# EAGLE schematic Interface (EAGLE 9.6.2)
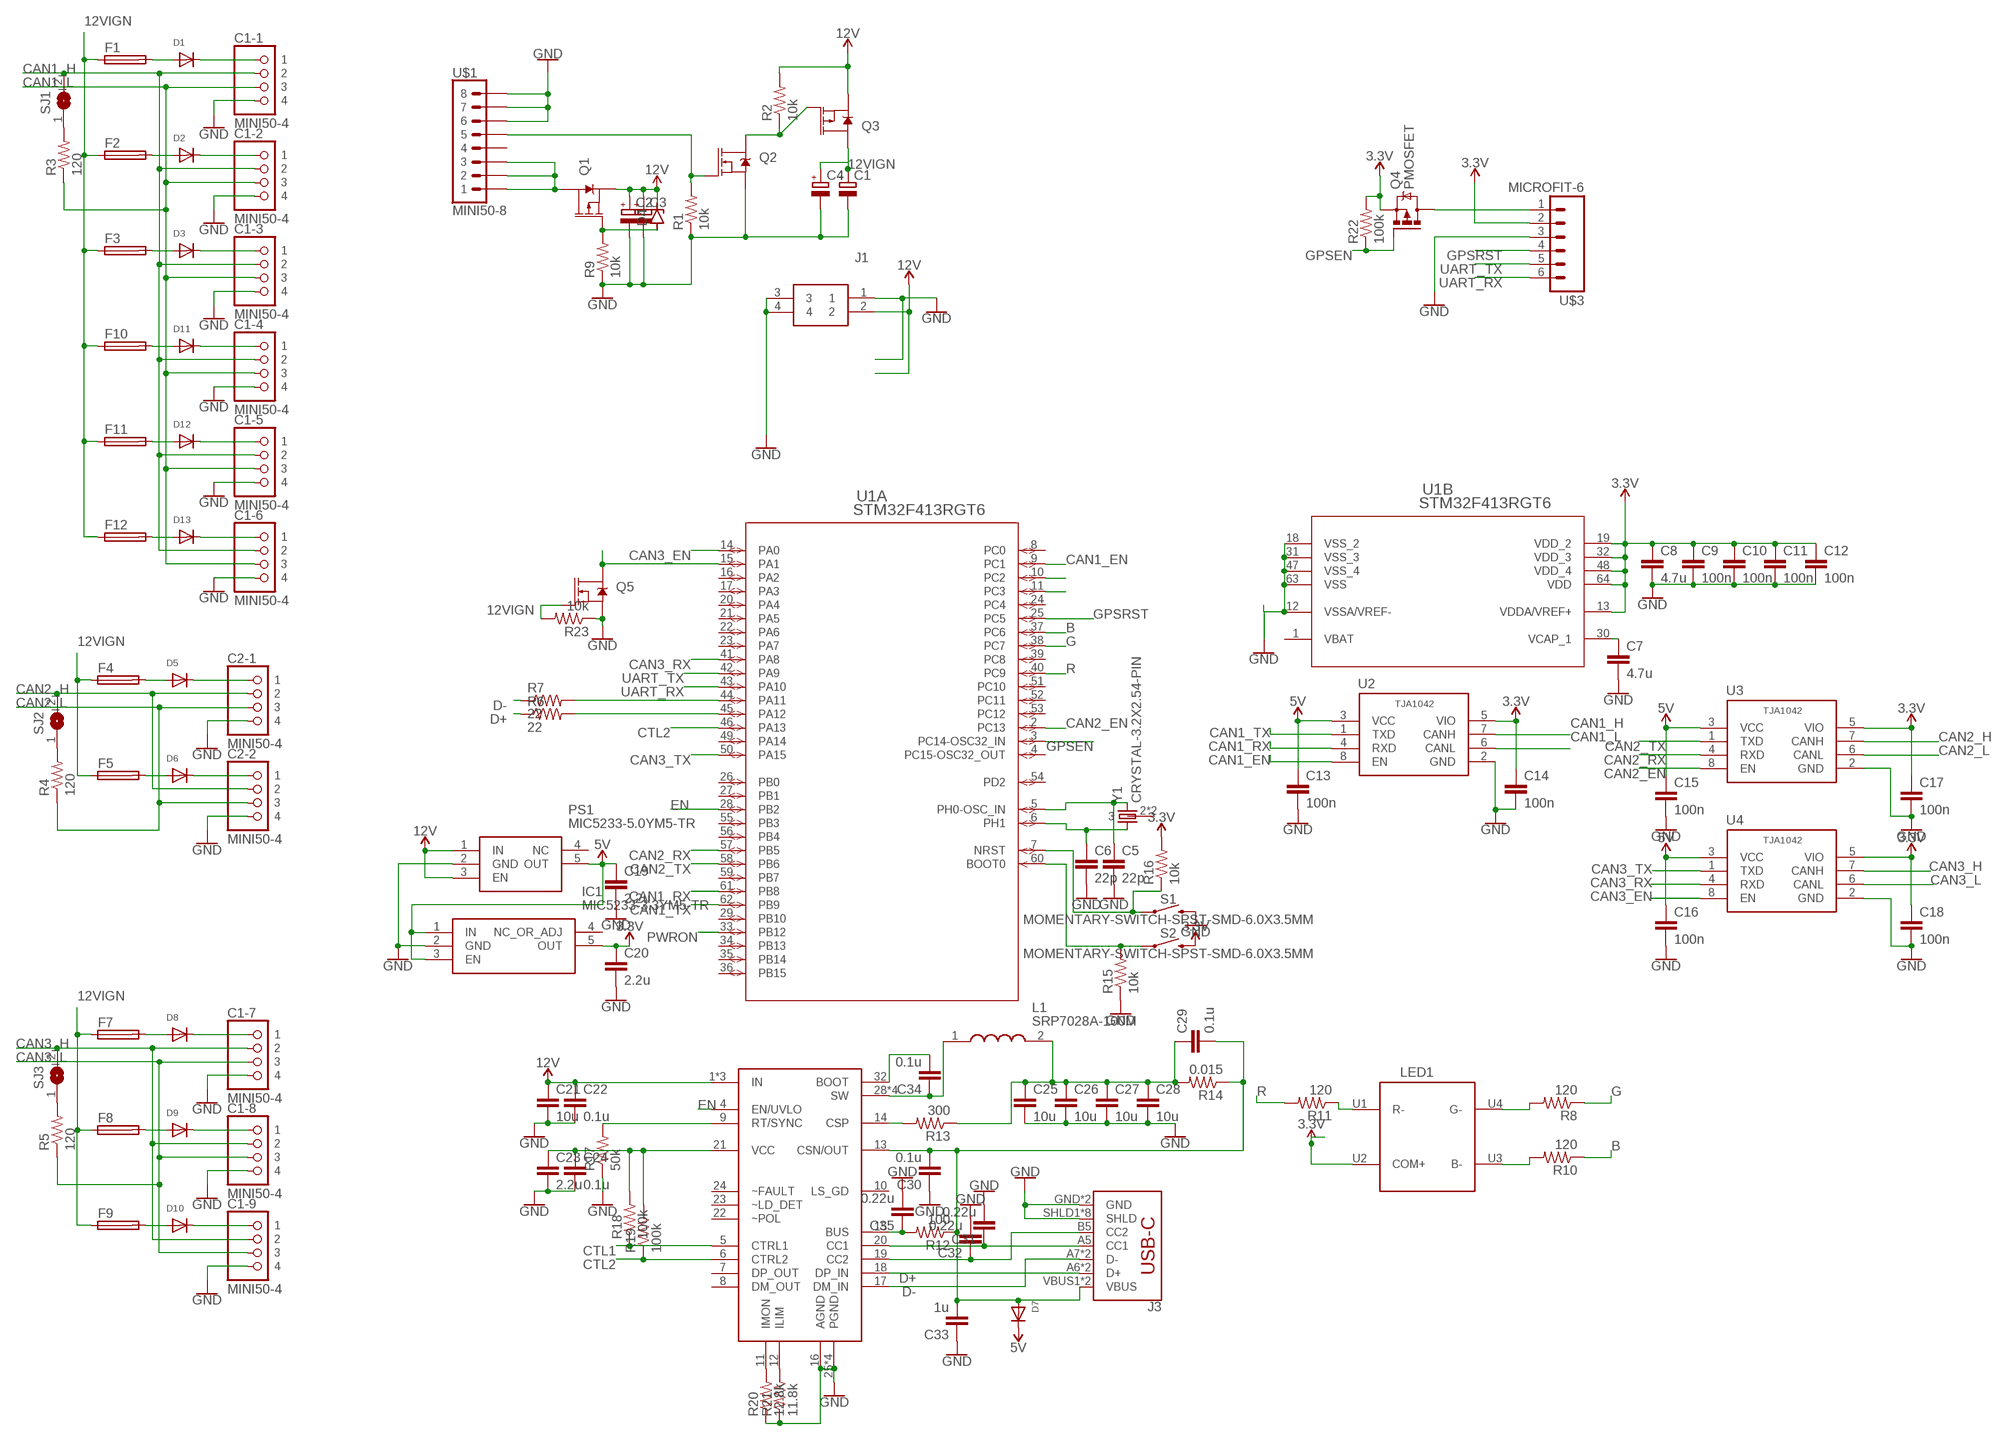
[diagram p0: schematic, sheet 1]

## Parts
C1  CPOL-EU153CLV-1010  [153CLV-1010]
C1-1  MINI50-4  [MINI50]
C1-2  MINI50-4  [MINI50]
C1-3  MINI50-4  [MINI50]
C1-4  MINI50-4  [MINI50]
C1-5  MINI50-4  [MINI50]
C1-6  MINI50-4  [MINI50]
C1-7  MINI50-4  [MINI50]
C1-8  MINI50-4  [MINI50]
C1-9  MINI50-4  [MINI50]
C2  CPOL-EU153CLV-1010  [153CLV-1010]
C2-1  MINI50-4  [MINI50]
C2-2  MINI50-4  [MINI50]
C3  CPOL-EU153CLV-0505  [153CLV-0505]
C4  CPOL-EU153CLV-0505  [153CLV-0505]
C5  22p  C0603  [0603-C]
C6  22p  C0603  [0603-C]
C7  4.7u  C0603  [0603-C]
C8  4.7u  C0603  [0603-C]
C9  100n  C0603  [0603-C]
C10  100n  C0603  [0603-C]
C11  100n  C0603  [0603-C]
C12  100n  C0603  [0603-C]
C13  100n  C0603  [0603-C]
C14  100n  C0603  [0603-C]
C15  100n  C0603  [0603-C]
C16  100n  C0603  [0603-C]
C17  100n  C0603  [0603-C]
C18  100n  C0603  [0603-C]
C19  2.2u  C0603  [0603-C]
C20  2.2u  C0603  [0603-C]
C21  10u  C0603  [0603-C]
C22  0.1u  C0603  [0603-C]
C23  2.2u  C0603  [0603-C]
C24  0.1u  C0603  [0603-C]
C25  10u  C0603  [0603-C]
C26  10u  C0603  [0603-C]
C27  10u  C0603  [0603-C]
C28  10u  C0603  [0603-C]
C29  0.1u  C0603  [0603-C]
C30  0.1u  C0603  [0603-C]
C31  0.22u  C0603  [0603-C]
C32  0.22u  C0603  [0603-C]
C33  1u  C0603  [0603-C]
C34  0.1u  C0603  [0603-C]
C35  0.22u  C0603  [0603-C]
D1  DIODESOD-323F  [SOD-323F]
D2  DIODESOD-323F  [SOD-323F]
D3  DIODESOD-323F  [SOD-323F]
D4  ZENER_DO-219-AB(SOD123F)  [SODFL3718X115]
D5  DIODESOD-323F  [SOD-323F]
D6  DIODESOD-323F  [SOD-323F]
D7  DIODESOD-323F  [SOD-323F]
D8  DIODESOD-323F  [SOD-323F]
D9  DIODESOD-323F  [SOD-323F]
D10  DIODESOD-323F  [SOD-323F]
D11  DIODESOD-323F  [SOD-323F]
D12  DIODESOD-323F  [SOD-323F]
D13  DIODESOD-323F  [SOD-323F]
F1  FUSE_CHIP-1206(3216-METRIC)  [FUSC3215X82N]
F2  FUSE_CHIP-1206(3216-METRIC)  [FUSC3215X82N]
F3  FUSE_CHIP-1206(3216-METRIC)  [FUSC3215X82N]
F4  FUSE_CHIP-1206(3216-METRIC)  [FUSC3215X82N]
F5  FUSE_CHIP-1206(3216-METRIC)  [FUSC3215X82N]
F7  FUSE_CHIP-1206(3216-METRIC)  [FUSC3215X82N]
F8  FUSE_CHIP-1206(3216-METRIC)  [FUSC3215X82N]
F9  FUSE_CHIP-1206(3216-METRIC)  [FUSC3215X82N]
F10  FUSE_CHIP-1206(3216-METRIC)  [FUSC3215X82N]
F11  FUSE_CHIP-1206(3216-METRIC)  [FUSC3215X82N]
F12  FUSE_CHIP-1206(3216-METRIC)  [FUSC3215X82N]
IC1  MIC5233-3.3YM5-TR  [SOT95P280X145-5N]
J1  34912-8020  [0349128020]
J3  USB-C-BREAKOUT_SPARKFUN-CONNECTORS_USB_C16PIN  [USB-C-BREAKOUT_SPARKFUN-CONNECTORS_USB-C-16P]
L1  SRP7028A-100M  [SRP7028A3R3M]
LED1  CREE-RGB-CLVBA  [CREE-RGB-CLVBA]
PS1  MIC5233-5.0YM5-TR  [SOT95P280X145-5N]
Q1  6.5A/20V/35mΩ  MOSFET_PCH-KI4435DY  [SO08]
Q2  5.8A/30V/35mΩ  MOSFET-NCH-AO3404A  [SOT23-3]
Q3  6.5A/20V/35mΩ  MOSFET_PCH-KI4435DY  [SO08]
Q4  PMOSFET  PMOSFET_SOT23  [SOT23]
Q5  5.8A/30V/35mΩ  MOSFET-NCH-AO3404A  [SOT23-3]
R1  10k  R0402  [0402-R]
R2  10k  R0402  [0402-R]
R3  120  R0402  [0402-R]
R4  120  R0402  [0402-R]
R5  120  R0402  [0402-R]
R6  22  R0402  [0402-R]
R7  22  R0402  [0402-R]
R8  120  R0402  [0402-R]
R9  10k  R0402  [0402-R]
R10  120  R0402  [0402-R]
R11  120  R0402  [0402-R]
R12  100  R0402  [0402-R]
R13  300  R0402  [0402-R]
R14  0.015  R0402  [0402-R]
R15  10k  R0402  [0402-R]
R16  10k  R0402  [0402-R]
R17  50k  R0402  [0402-R]
R18  100k  R0402  [0402-R]
R19  100k  R0402  [0402-R]
R20  12.8k  R0402  [0402-R]
R21  11.8k  R0402  [0402-R]
R22  100k  R0402  [0402-R]
R23  10k  R0402  [0402-R]
S1  MOMENTARY-SWITCH-SPST-SMD-6.0X3.5MM  [TACTILE_SWITCH_SMD_6.0X3.5MM]
S2  MOMENTARY-SWITCH-SPST-SMD-6.0X3.5MM  [TACTILE_SWITCH_SMD_6.0X3.5MM]
SJ1  SJ  [SJ]
SJ2  SJ  [SJ]
SJ3  SJ  [SJ]
U1  STM32F413RGT6  [LQFP64-10X10MM]
U2  TJA1042  [NXP_SEMICONDUCTORS_TJA1042T-3-CM_118_0]
U3  TJA1042  [NXP_SEMICONDUCTORS_TJA1042T-3-CM_118_0]
U4  TJA1042  [NXP_SEMICONDUCTORS_TJA1042T-3-CM_118_0]
U$1  MINI50-8  [MINI50-8]
U$2  TPS25830  [RHB.32]
U$3  MICROFIT-6  [MICROFIT-6]
Y1  CRYSTAL-3.2X2.54-PIN  [XTAL-3.2X2.5]

## Nets
3.3V: C8.1 C9.1 C10.1 C11.1 C12.1 C14.1 C17.1 C18.1 C20.1 IC1.5(OUT) LED1.U2(COM+) Q4.2(S) R16.2 R22.2 S2.2 U1.13(B:VDDA/VREF+) U1.19(B:VDD_2) U1.32(B:VDD_3) U1.48(B:VDD_4) U1.64(B:VDD) U2.5(VIO) U3.5(VIO) U4.5(VIO) U$3.2
5V: C13.1 C15.1 C16.1 C19.1 D7.C IC1.1(IN) IC1.3(EN) PS1.5(OUT) U2.3(VCC) U3.3(VCC) U4.3(VCC)
12V: C2.+ C3.+ C21.1 C22.1 D4.2(C) J1.2 PS1.1(IN) PS1.3(EN) Q1.1(S) Q1.2(S) Q1.3(S) Q3.1(S) Q3.2(S) Q3.3(S) R2.2 U$2.1(IN) U$2.2(IN) U$2.3(IN)
12VIGN: C1.+ C4.+ F1.1 F2.1 F3.1 F4.1 F5.1 F7.1 F8.1 F9.1 F10.1 F11.1 F12.1 Q3.5(D) Q3.6(D) Q3.7(D) Q3.8(D) Q5.1(G) R23.2
B: R10.1 U1.37(A:PC6)
CAN1_EN: U1.9(A:PC1) U2.8(EN)
CAN1_H: C1-1.3 C1-2.3 C1-3.3 C1-4.3 C1-5.3 C1-6.3 SJ1.2 U2.7(CANH)
CAN1_L: C1-1.2 C1-2.2 C1-3.2 C1-4.2 C1-5.2 C1-6.2 R3.1 U2.6(CANL)
CAN1_RX: U1.61(A:PB8) U2.4(RXD)
CAN1_TX: U1.62(A:PB9) U2.1(TXD)
CAN2_EN: U1.2(A:PC13) U3.8(EN)
CAN2_H: C2-1.3 C2-2.3 SJ2.2 U3.7(CANH)
CAN2_L: C2-1.2 C2-2.2 R4.1 U3.6(CANL)
CAN2_RX: U1.57(A:PB5) U3.4(RXD)
CAN2_TX: U1.58(A:PB6) U3.1(TXD)
CAN3_EN: U1.14(A:PA0) U4.8(EN)
CAN3_H: C1-7.3 C1-8.3 C1-9.3 SJ3.2 U4.7(CANH)
CAN3_L: C1-7.2 C1-8.2 C1-9.2 R5.1 U4.6(CANL)
CAN3_RX: U1.41(A:PA8) U4.4(RXD)
CAN3_TX: U1.50(A:PA15) U4.1(TXD)
CTL1: R18.1 U$2.5(CTRL1)
CTL2: R19.1 U1.46(A:PA13) U$2.6(CTRL2)
D+: J3.A6(D+) J3.B6(D+) R6.1 U$2.18(DP_IN)
D-: J3.A7(D-) J3.B7(D-) R7.1 U$2.17(DM_IN)
EN: U1.28(A:PB2) U$2.4(EN/UVLO)
G: R8.1 U1.38(A:PC7)
GND: C1-1.1 C1-2.1 C1-3.1 C1-4.1 C1-5.1 C1-6.1 C1-7.1 C1-8.1 C1-9.1 C1.- C2-1.1 C2-2.1 C2.- C3.- C4.- C5.2 C6.2 C7.2 C8.2 C9.2 C10.2 C11.2 C12.2 C13.2 C14.2 C15.2 C16.2 C17.2 C18.2 C19.2 C20.2 C21.2 C22.2 C23.2 C24.2 C25.2 C26.2 C27.2 C28.2 C30.1 C31.2 C32.2 C33.1 C35.2 IC1.2(GND) J1.1 J1.3 J1.4 J3.GND J3.GND2(GND) J3.SHLD1(SHLD) J3.SHLD2(SHLD) J3.SHLD3(SHLD) J3.SHLD4(SHLD) J3.SHLD5(SHLD) J3.SHLD6(SHLD) J3.SHLD7(SHLD) J3.SHLD8(SHLD) PS1.2(GND) Q2.2(S) Q5.2(S) R1.1 R9.1 R15.1 R17.1 R20.1 R21.1 R23.1 S1.2 U1.12(B:VSSA/VREF-) U1.18(B:VSS_2) U1.31(B:VSS_3) U1.47(B:VSS_4) U1.63(B:VSS) U2.2(GND) U3.2(GND) U4.2(GND) U$1.P$6 U$1.P$7 U$1.P$8 U$2.16(AGND) U$2.25(PGND) U$2.26(PGND) U$2.27(PGND) U$2.PAD(PGND) U$3.3
GPSEN: Q4.1(G) R22.1 U1.3(A:PC14-OSC32_IN)
GPSRST: U1.25(A:PC5) U$3.4
N$1: D1.A F1.2
N$2: C1-1.4 D1.C
N$3: D2.A F2.2
N$4: C1-2.4 D2.C
N$5: D3.A F3.2
N$6: C1-3.4 D3.C
N$7: R3.2 SJ1.1
N$8: D5.A F4.2
N$9: C2-1.4 D5.C
N$10: Q1.5(D) Q1.6(D) Q1.7(D) Q1.8(D) U$1.P$1 U$1.P$2 U$1.P$3
N$11: D6.A F5.2
N$12: Q2.1(G) R1.2 U$1.P$5
N$13: C2-2.4 D6.C
N$14: C5.1 U1.5(A:PH0-OSC_IN) Y1.3
N$15: Q2.3(D) Q3.4(G) R2.1
N$16: R7.2 U1.44(A:PA11)
N$17: R4.2 SJ2.1
N$18: D8.A F7.2
N$19: C1-7.4 D8.C
N$20: D9.A F8.2
N$21: C1-8.4 D9.C
N$22: D10.A F9.2
N$23: C1-9.4 D10.C
N$24: R5.2 SJ3.1
N$25: D12.A F11.2
N$26: D4.1(A) Q1.4(G) R9.2
N$27: D11.A F10.2
N$28: C1-4.4 D11.C
N$29: C1-5.4 D12.C
N$30: D13.A F12.2
N$31: C1-6.4 D13.C
N$32: R6.2 U1.45(A:PA12)
N$33: C31.1 J3.A5(CC1) U$2.20(CC1)
N$34: C32.1 J3.B5(CC2) U$2.19(CC2)
N$35: U1.11(A:PC3)
N$36: U1.10(A:PC2)
N$37: R20.2 U$2.11(IMON)
N$38: R16.1 S1.1 U1.7(A:NRST)
N$39: R15.2 S2.1 U1.60(A:BOOT0)
N$40: C7.1 U1.30(B:VCAP_1)
N$41: R21.2 U$2.12(ILIM)
N$42: C29.2 C30.2 C33.2 D7.A J3.VBUS1(VBUS) J3.VBUS2(VBUS) R12.1 R14.1 U$2.13(CSN/OUT)
N$43: C6.1 U1.6(A:PH1) Y1.1
N$44: C34.1 L1.1 U$2.28(SW) U$2.29(SW) U$2.30(SW) U$2.31(SW)
N$45: LED1.U4(G-) R8.2
N$46: LED1.U1(R-) R11.1
N$47: LED1.U3(B-) R10.2
N$49: Q4.3(D) U$3.1
N$50: Q5.3(D) U1.15(A:PA1)
N$52: C35.1 R12.2 U$2.15(BUS)
N$54: C23.1 C24.1 R18.2 R19.2 U$2.21(VCC)
N$56: C25.1 C26.1 C27.1 C28.1 C29.1 L1.2 R13.1 R14.2
N$57: R13.2 U$2.14(CSP)
N$58: C34.2 U$2.32(BOOT)
N$59: R17.2 U$2.9(RT/SYNC)
PWRON: U1.33(A:PB12)
R: R11.2 U1.40(A:PC9)
UART_RX: U1.43(A:PA10) U$3.6
UART_TX: U1.42(A:PA9) U$3.5
Unconnected: IC1.4(NC_OR_ADJ) PS1.4(NC) U1.4(A:PC15-OSC32_OUT) U1.8(A:PC0) U1.16(A:PA2) U1.17(A:PA3) U1.20(A:PA4) U1.21(A:PA5) U1.22(A:PA6) U1.23(A:PA7) U1.24(A:PC4) U1.26(A:PB0) U1.27(A:PB1) U1.29(A:PB10) U1.34(A:PB13) U1.35(A:PB14) U1.36(A:PB15) U1.39(A:PC8) U1.49(A:PA14) U1.51(A:PC10) U1.52(A:PC11) U1.53(A:PC12) U1.54(A:PD2) U1.55(A:PB3) U1.56(A:PB4) U1.59(A:PB7) U$1.P$4 U$2.7(DP_OUT) U$2.8(DM_OUT) U$2.10(LS_GD) U$2.22(~POL) U$2.23(~LD_DET) U$2.24(~FAULT) Y1.2 Y1.4

## Power pins joined to a net without a drawn wire
VBAT: U1.1(B:VBAT)

## Library data of the parts
C1-C4 = rcl:CPOL-EU: POLARIZED CAPACITOR, European symbol; SPICEPREFIX: C
C1-1-C1-9 C2-1 C2-2 = interceptor:MINI50-4
C5-C35 = comma.ai:C
D1-D3 D5-D13 = adafruit:DIODE: Diode SMADIODE - SMA Surface Mount Package 20V 1A Schottky Diode Digikey: 641-1014-6-ND DO-1N4148 - Through Hole Small Current Diode SOD-123 20V 1 A (.5mV Vf) Schottky Diode - Digikey: MBRX120TPMSCT-ND SOD-323 10V 570mA (.38mV Vf, 3ns) Schottky Diode - Digikey: ZLLS410CT-ND SOD-523 30V 30mA Schottky Diode (RB751S-40TE61) - Digikey: RB751S-40TE61CT-ND SOT23-R/W - SOT23 Package (R = Solder Paste/Reflow Ovens, W = Hand-Soldering) BAT54Film 40V 300mA - Digikey: 497-7162-1-ND
D4 = Diode:ZENER: Zener Diode - Generic; CATEGORY: Diode; SUB-CATEGORY: Zener
F1-F5 F7-F12 = Circuit-Protection:FUSE: Fuse - Generic; CATEGORY: Circuit-Protection; SUB-CATEGORY: Fuse
IC1 = SamacSys_Parts:MIC5233-3.3YM5-TR: High Input Voltage Low IQ UCAP LDO Regulator Source: Datasheet <http://ww1.microchip.com/downloads/en/DeviceDoc/MIC5233-Data-Sheet-DS20006033D.pdf>; DESCRIPTION: High Input Voltage Low IQ UCAP LDO Regulator; HEIGHT: 1.45mm; MANUFACTURER_NAME: Microchip; MANUFACTURER_PART_NUMBER: MIC5233-3.3YM5-TR; MOUSER_PART_NUMBER: 998-MIC5233-3.3YM5TR; MOUSER_PRICE-STOCK: https://www.mouser.co.uk/ProductDetail/Microchip-Technology-Micrel/MIC5233-33YM5-TR?qs=U6T8BxXiZAWDhshLMgpaLQ%3D%3D
J1 = SamacSys_Parts:34912-8020: Molex Mini50 Series, 34912 Series Number, 1 Row 2 Way Surface Mount Plug PCB Header, with SMT Termination Method Source: Datasheet <https://www.molex.com/pdm_docs/sd/349128020_sd.pdf>; DESCRIPTION: Molex Mini50 Series, 34912 Series Number, 1 Row 2 Way Surface Mount Plug PCB Header, with SMT Termination Method; HEIGHT: 9mm; MANUFACTURER_NAME: Molex; MANUFACTURER_PART_NUMBER: 34912-8020; MOUSER_PART_NUMBER: 538-34912-8020; MOUSER_PRICE-STOCK: https://www.mouser.co.uk/ProductDetail/Molex/34912-8020?qs=jj7GbYRQuObyP9O5PVDUYw%3D%3D
J3 = ROTR-Wireless:USB-C-BREAKOUT_SPARKFUN-CONNECTORS_USB_C: USB Type C 16Pin Connector Super Speed pins not available on the 16-pin purely SMD connector so this part is best for USB 2.0 implementations. D1 and D2 are tied together enabling D+/- no matter which way the cable is plugged into the connector. The two channel configuration pins (CC1/2) are exposed. These are normally connected to ground via 5.1k resistors but can be reconfigured for high current/high power applications.; PROD_ID: CONN-14122
L1 = SRP7028A-100M:SRP7028A-100M: Bourns SRP7028A Series Shielded Wire-wound SMD Inductor with a Carbonyl Powder Core, 10 uH +/-20% 3.5A Idc Source: Datasheet <https://www.mouser.com/datasheet/2/54/srp7028a-1391359.pdf>; ARROW_PART_NUMBER: SRP7028A-100M; ARROW_PRICE-STOCK: https://www.arrow.com/en/products/srp7028a-100m/bourns; DESCRIPTION: Bourns SRP7028A Series Shielded Wire-wound SMD Inductor with a Carbonyl Powder Core, 10 uH +/-20% 3.5A Idc; HEIGHT: 3mm; MANUFACTURER_NAME: Bourns; MANUFACTURER_PART_NUMBER: SRP7028A-100M; MOUSER_PART_NUMBER: 652-SRP7028A-100M; MOUSER_PRICE-STOCK: https://www.mouser.co.uk/ProductDetail/Bourns/SRP7028A-100M?qs=7z%252BmIopC6%2FIen3yqnoi56A%3D%3D
LED1 = comma.ai:CREE-RGB-CLVBA
PS1 = SamacSys_Parts:MIC5233-5.0YM5-TR: MICROCHIP - MIC5233-5.0YM5-TR - LDO, REG, 36VIN, 0.1A, 5V, 2%, 5SOT23 Source: Datasheet <https://componentsearchengine.com/Datasheets/2/MIC5233-5.0YM5-TR.pdf>; DESCRIPTION: MICROCHIP - MIC5233-5.0YM5-TR - LDO, REG, 36VIN, 0.1A, 5V, 2%, 5SOT23; HEIGHT: 1.45mm; MANUFACTURER_NAME: Microchip; MANUFACTURER_PART_NUMBER: MIC5233-5.0YM5-TR; MOUSER_PART_NUMBER: 998-MIC5233-5.0YM5TR; MOUSER_PRICE-STOCK: https://www.mouser.co.uk/ProductDetail/Microchip-Technology-Micrel/MIC5233-50YM5-TR?qs=U6T8BxXiZAWSnpCHgrMajw%3D%3D
Q1 Q3 = SparkFun-DiscreteSemi:MOSFET_PCH: P-channel MOSFETs Voltage controlled devices that allow control of high current outputs. SparkFun Products: SparkFun ESP32 Thing <https://www.sparkfun.com/products/13907> SparkFun ESP8266 Thing <https://www.sparkfun.com/products/13231>; PROD_ID: TRANS-08355
Q2 Q5 = SparkFun-DiscreteSemi:MOSFET-NCH: N-channel MOSFETs Voltage controlled devices that allow control of high current outputs. SparkFun Products: SparkFun OpenScale <https://www.sparkfun.com/products/13261> SparkFun Digital Sandbox <https://www.sparkfun.com/products/12651> SparkFun Monster Moto Shield <https://www.sparkfun.com/products/10182> SparkFun MOSFET Power Controller <https://www.sparkfun.com/products/11214>; PROD_ID: TRANS-12988
Q4 = Transistor:PMOSFET: P-Channel MOSFET - Generic; CATEGORY: Transistor; SUB-CATEGORY: MOSFET; TYPE: P-Channel
R1-R5 R8-R14 R23 = interceptor:R
R6 R7 R15-R22 = comma.ai:R
S1 S2 = SparkFun-Switches:MOMENTARY-SWITCH-SPST: Momentary Switch (Pushbutton) - SPST Normally-open (NO) SPST momentary switches (buttons, pushbuttons). Variants PTH-12MM - 12mm square, through-hole Momentary Pushbutton Switch - 12mm Square <https://www.sparkfun.com/products/9190> (COM-09190) PTH-6.0MM, PTH-6.0MM-KIT - 6.0mm square, through-hole Mini Pushbutton Switch <https://www.sparkfun.com/products/97> (COM-00097) KIT package intended for soldering kit's - only one side of pads' copper is exposed. PTH-RIGHT-ANGLE-KIT - Right-angle, through-hole Right Angle Tactile Button <https://www.sparkfun.com/products/10791> - Used on SparkFun BigTime Watch Kit <https://www.sparkfun.com/products/11734> SMD-12MM - 12mm square, surface-mount Tactile Button - SMD (12mm) <https://www.sparkfun.com/products/12993> (COM-12993) Used on SparkFun PicoBoard <https://www.sparkfun.com/products/11888> SMD-4.5MM - 4.5mm Square Trackball Switch Used on SparkFun Blackberry Trackballer Breakout <https://www.sparkfun.com/products/13169> SMD-4.6MMX2.8MM - 4.60mm x 2.80mm, surface mount Used on SparkFun SAMD21 Mini Breakout <https://www.sparkfun.com/products/13664> SMD-5.2MM, SMD-5.2-REDUNDANT - 5.2mm square, surface-mount Mini Pushbutton Switch - SMD <https://www.sparkfun.com/products/8720> (COM-08720) Used on Arduino Pro Mini <https://www.sparkfun.com/products/11114> REDUNDANT package connects both switch circuits together SMD-6.0X3.5MM - 6.0 x 3.5mm, surface mount Momentary Reset Switch SMD <https://www.sparkfun.com/products/8229> (COM-08229) SMD-6.2MM-TALL - 6.2mm square, surface mount Tactile Button - SMD (6mm) <https://www.sparkfun.com/products/12992> Used on SparkFun Digital Sandbox <https://www.sparkfun.com/products/12651> SMD-RIGHT-ANGLE - Right-angle, surface mount Used on SparkFun Block for Intel® Edison - Arduino <https://www.sparkfun.com/products/13036>; PROD_ID: SWCH-00815; SF_SKU: COM-08229
SJ1-SJ3 = jumper:SJ: SMD solder JUMPER
U1 = interceptor:STM32F413RGT6; BUILT_BY: EMA_UL_Team; COPYRIGHT: Copyright (C) 2018 Accelerated Designs. All rights reserved; MANUFACTURER_PART_NUMBER: STM32F413RGT6; SOURCELIBRARY: Updates_to_database_2020-10-19; VENDOR: STMicroelectronics
U2-U4 = CM,118:TJA1042
U$1 = interceptor:MINI50-8
U$2 = packages(ti):TPS25830
U$3 = interceptor:MICROFIT-6
Y1 = comma.ai:CRYSTAL-3.2X2.5